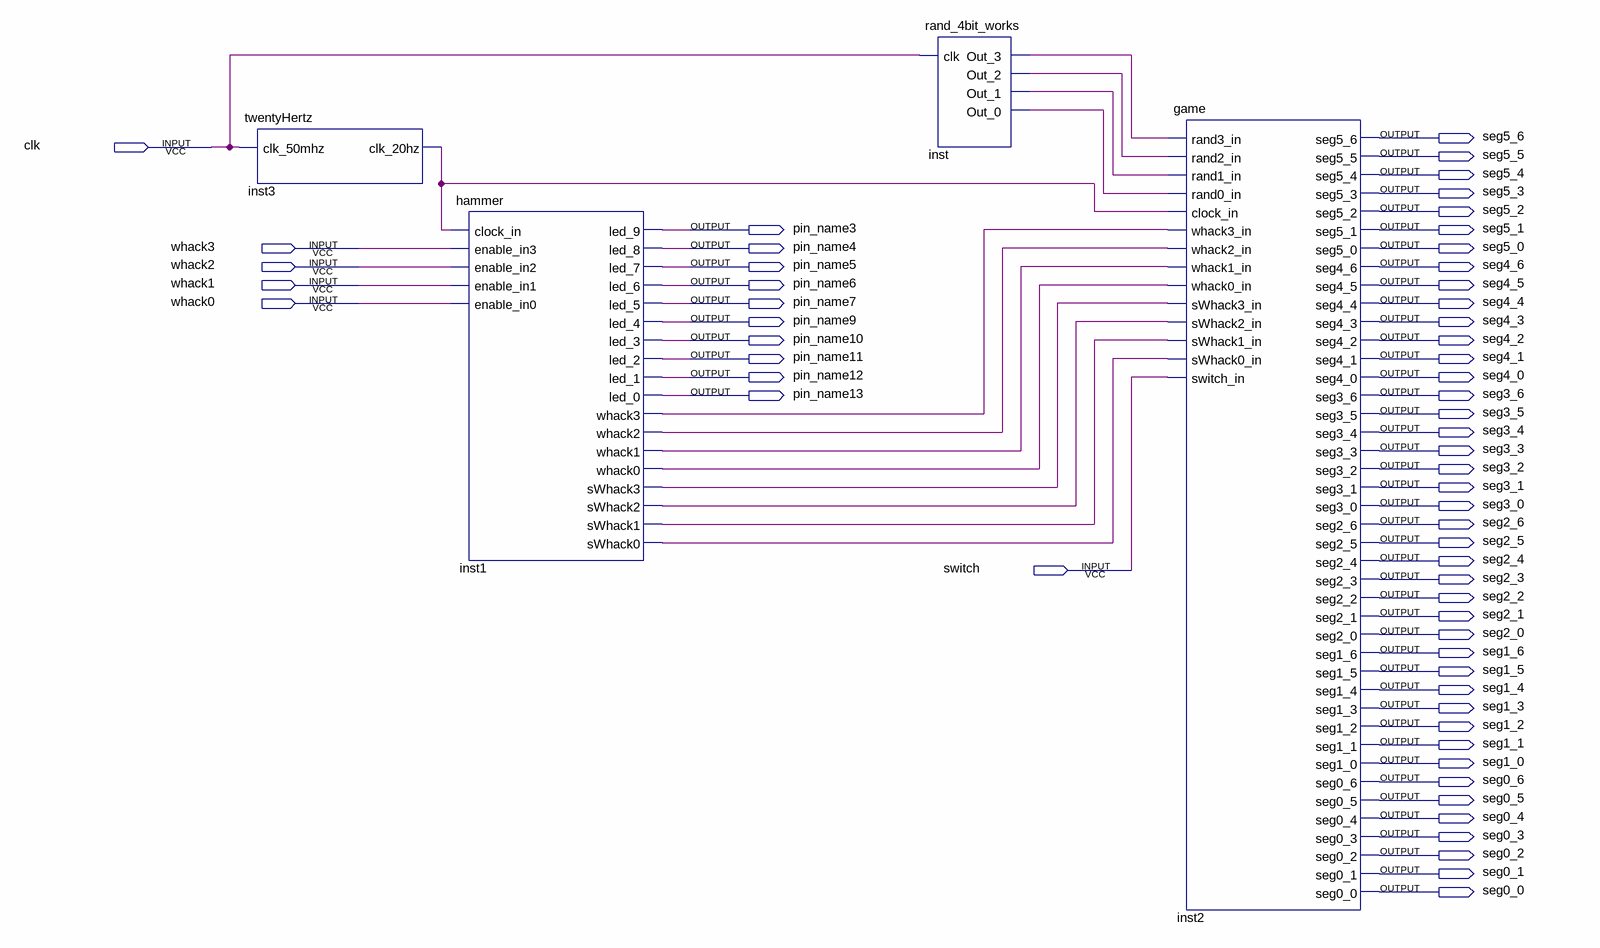
[diagram p0: schematic sheet]
// Quartus schematic Super_Slug_A_Bug.bdf as structural Verilog: 4 symbols, 58 pins
module Super_Slug_A_Bug (
  input  clk,
  input  whack3,
  input  whack2,
  input  whack1,
  input  whack0,
  input  switch,
  output seg5_6,
  output seg5_5,
  output seg5_4,
  output seg5_3,
  output seg5_2,
  output pin_name3,
  output seg5_1,
  output pin_name4,
  output seg5_0,
  output pin_name5,
  output seg4_6,
  output pin_name6,
  output seg4_5,
  output pin_name7,
  output seg4_4,
  output pin_name9,
  output seg4_3,
  output pin_name10,
  output seg4_2,
  output pin_name11,
  output seg4_1,
  output pin_name12,
  output seg4_0,
  output pin_name13,
  output seg3_6,
  output seg3_5,
  output seg3_4,
  output seg3_3,
  output seg3_2,
  output seg3_1,
  output seg3_0,
  output seg2_6,
  output seg2_5,
  output seg2_4,
  output seg2_3,
  output seg2_2,
  output seg2_1,
  output seg2_0,
  output seg1_6,
  output seg1_5,
  output seg1_4,
  output seg1_3,
  output seg1_2,
  output seg1_1,
  output seg1_0,
  output seg0_6,
  output seg0_5,
  output seg0_4,
  output seg0_3,
  output seg0_2,
  output seg0_1,
  output seg0_0
);

  wire inst1_swhack0, inst1_swhack1, inst1_swhack2, inst1_swhack3, inst1_whack0, inst1_whack1, inst1_whack2,
       inst1_whack3, inst3_clk_20hz, inst_out_0, inst_out_1, inst_out_2, inst_out_3;

  twentyHertz inst3 (.clk_50mhz(clk), .clk_20hz(inst3_clk_20hz));
  hammer inst1 (
    .clock_in(inst3_clk_20hz), .enable_in3(whack3), .enable_in2(whack2), .enable_in1(whack1),
    .enable_in0(whack0), .led_9(pin_name3), .led_8(pin_name4), .led_7(pin_name5), .led_6(pin_name6),
    .led_5(pin_name7), .led_4(pin_name9), .led_3(pin_name10), .led_2(pin_name11), .led_1(pin_name12),
    .led_0(pin_name13), .whack3(inst1_whack3), .whack2(inst1_whack2), .whack1(inst1_whack1),
    .whack0(inst1_whack0), .sWhack3(inst1_swhack3), .sWhack2(inst1_swhack2), .sWhack1(inst1_swhack1),
    .sWhack0(inst1_swhack0));
  rand_4bit_works inst (.clk(clk), .Out_3(inst_out_3), .Out_2(inst_out_2), .Out_1(inst_out_1), .Out_0(inst_out_0));
  game inst2 (
    .rand3_in(inst_out_3), .rand2_in(inst_out_2), .rand1_in(inst_out_1), .rand0_in(inst_out_0),
    .clock_in(inst3_clk_20hz), .whack3_in(inst1_whack3), .whack2_in(inst1_whack2), .whack1_in(inst1_whack1),
    .whack0_in(inst1_whack0), .sWhack3_in(inst1_swhack3), .sWhack2_in(inst1_swhack2),
    .sWhack1_in(inst1_swhack1), .sWhack0_in(inst1_swhack0), .switch_in(switch), .seg5_6(seg5_6),
    .seg5_5(seg5_5), .seg5_4(seg5_4), .seg5_3(seg5_3), .seg5_2(seg5_2), .seg5_1(seg5_1), .seg5_0(seg5_0),
    .seg4_6(seg4_6), .seg4_5(seg4_5), .seg4_4(seg4_4), .seg4_3(seg4_3), .seg4_2(seg4_2), .seg4_1(seg4_1),
    .seg4_0(seg4_0), .seg3_6(seg3_6), .seg3_5(seg3_5), .seg3_4(seg3_4), .seg3_3(seg3_3), .seg3_2(seg3_2),
    .seg3_1(seg3_1), .seg3_0(seg3_0), .seg2_6(seg2_6), .seg2_5(seg2_5), .seg2_4(seg2_4), .seg2_3(seg2_3),
    .seg2_2(seg2_2), .seg2_1(seg2_1), .seg2_0(seg2_0), .seg1_6(seg1_6), .seg1_5(seg1_5), .seg1_4(seg1_4),
    .seg1_3(seg1_3), .seg1_2(seg1_2), .seg1_1(seg1_1), .seg1_0(seg1_0), .seg0_6(seg0_6), .seg0_5(seg0_5),
    .seg0_4(seg0_4), .seg0_3(seg0_3), .seg0_2(seg0_2), .seg0_1(seg0_1), .seg0_0(seg0_0));
endmodule
